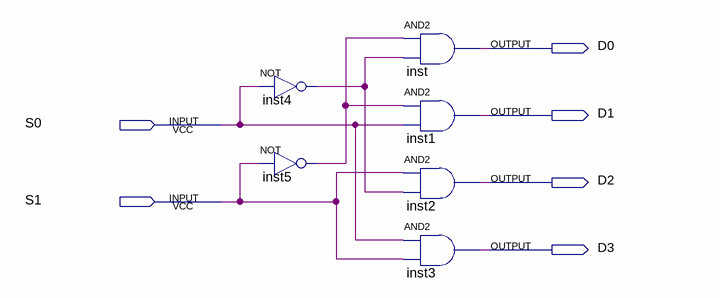
[diagram p0: schematic sheet]
// Quartus schematic Decoder2to4.bdf as structural Verilog: 6 symbols, 6 pins
module Decoder2to4 (
  input  S0,
  input  S1,
  output D0,
  output D1,
  output D2,
  output D3
);

  wire inst4_out, inst5_out;

  not inst4 (inst4_out, S0);
  not inst5 (inst5_out, S1);
  and inst (D0, inst5_out, inst4_out);
  and inst1 (D1, inst5_out, S0);
  and inst2 (D2, S1, inst4_out);
  and inst3 (D3, S0, S1);
endmodule
